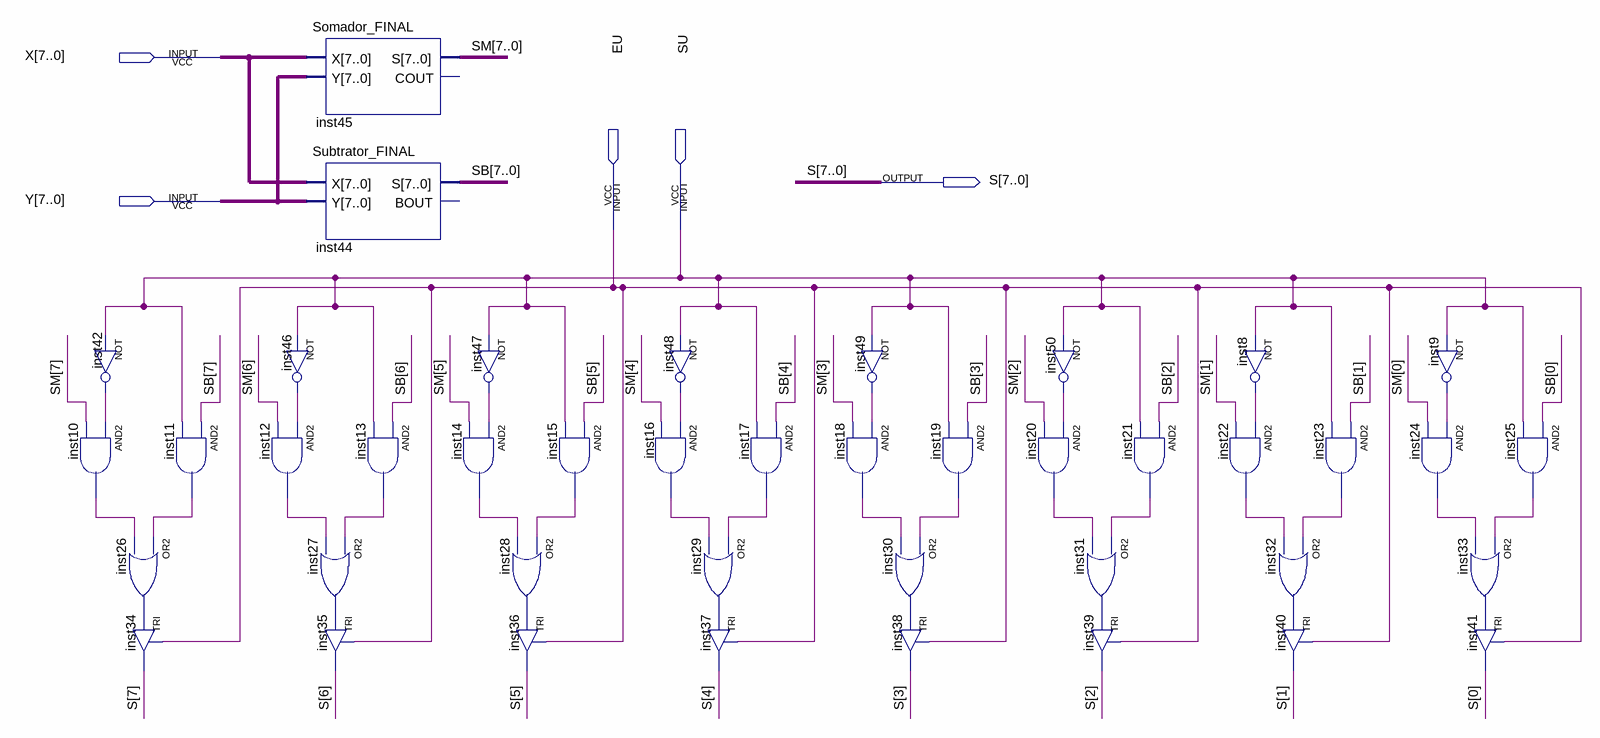
[diagram p0: schematic sheet]
// Quartus schematic Somador_Subtrator.bdf as structural Verilog: 42 symbols, 5 pins
module Somador_Subtrator (
  input  [7:0] X,
  input  [7:0] Y,
  input  EU,
  input  SU,
  output [7:0] S
);

  wire inst8_out, inst9_out, inst10_out, inst11_out, inst12_out, inst13_out, inst14_out, inst15_out,
       inst16_out, inst17_out, inst18_out, inst19_out, inst20_out, inst21_out, inst22_out, inst23_out,
       inst24_out, inst25_out, inst26_out, inst27_out, inst28_out, inst29_out, inst30_out, inst31_out,
       inst32_out, inst33_out, inst42_out, inst46_out, inst47_out, inst48_out, inst49_out, inst50_out;
  wire [7:0] SB, SM;

  not inst42 (inst42_out, SU);
  and inst10 (inst10_out, inst42_out, SM[7]);
  or inst26 (inst26_out, inst11_out, inst10_out);
  TRI inst34 (.IN(inst26_out), .OE(EU), .OUT(S[7]));
  and inst11 (inst11_out, SB[7], SU);
  not inst46 (inst46_out, SU);
  and inst12 (inst12_out, inst46_out, SM[6]);
  Somador_FINAL inst45 (.X(X), .Y(Y), .S(SM));  // open: COUT
  Subtrator_FINAL inst44 (.X(X), .Y(Y), .S(SB));  // open: BOUT
  and inst13 (inst13_out, SB[6], SU);
  or inst27 (inst27_out, inst13_out, inst12_out);
  TRI inst35 (.IN(inst27_out), .OE(EU), .OUT(S[6]));
  not inst47 (inst47_out, SU);
  and inst14 (inst14_out, inst47_out, SM[5]);
  or inst28 (inst28_out, inst15_out, inst14_out);
  TRI inst36 (.IN(inst28_out), .OE(EU), .OUT(S[5]));
  and inst15 (inst15_out, SB[5], SU);
  not inst48 (inst48_out, SU);
  and inst16 (inst16_out, inst48_out, SM[4]);
  and inst17 (inst17_out, SB[4], SU);
  or inst29 (inst29_out, inst17_out, inst16_out);
  TRI inst37 (.IN(inst29_out), .OE(EU), .OUT(S[4]));
  not inst49 (inst49_out, SU);
  and inst18 (inst18_out, inst49_out, SM[3]);
  or inst30 (inst30_out, inst19_out, inst18_out);
  TRI inst38 (.IN(inst30_out), .OE(EU), .OUT(S[3]));
  and inst19 (inst19_out, SB[3], SU);
  not inst50 (inst50_out, SU);
  and inst20 (inst20_out, inst50_out, SM[2]);
  and inst21 (inst21_out, SB[2], SU);
  or inst31 (inst31_out, inst21_out, inst20_out);
  TRI inst39 (.IN(inst31_out), .OE(EU), .OUT(S[2]));
  not inst8 (inst8_out, SU);
  and inst22 (inst22_out, inst8_out, SM[1]);
  or inst32 (inst32_out, inst23_out, inst22_out);
  TRI inst40 (.IN(inst32_out), .OE(EU), .OUT(S[1]));
  and inst23 (inst23_out, SB[1], SU);
  not inst9 (inst9_out, SU);
  and inst24 (inst24_out, inst9_out, SM[0]);
  and inst25 (inst25_out, SB[0], SU);
  or inst33 (inst33_out, inst25_out, inst24_out);
  TRI inst41 (.IN(inst33_out), .OE(EU), .OUT(S[0]));
endmodule
